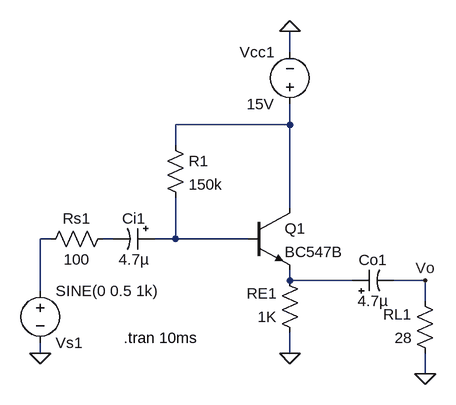
[diagram p0: schematic lab4.2f.asc]
lab4.2f.asc, the LTspice schematic file:
Version 4
SHEET 1 880 680
WIRE 224 -112 224 -144
WIRE 224 0 224 -32
WIRE 224 0 48 0
WIRE 48 32 48 0
WIRE 224 128 224 0
WIRE -144 176 -160 176
WIRE -48 176 -64 176
WIRE 48 176 48 112
WIRE 48 176 16 176
WIRE 160 176 48 176
WIRE 224 240 224 224
WIRE 320 240 224 240
WIRE 432 240 384 240
WIRE -160 256 -160 176
WIRE 432 272 432 240
WIRE -160 352 -160 336
WIRE 224 352 224 320
WIRE 432 384 432 352
FLAG 224 352 0
FLAG 224 -144 0
FLAG -160 352 0
FLAG 432 384 0
FLAG 432 240 Vo
SYMBOL res 240 336 R180
WINDOW 0 36 76 Left 2
WINDOW 3 36 40 Left 2
SYMATTR InstName RE1
SYMATTR Value 1K
SYMBOL npn 160 128 R0
SYMATTR InstName Q1
SYMATTR Value BC547B
SYMBOL voltage 224 -16 R180
WINDOW 0 24 96 Left 2
WINDOW 3 24 16 Left 2
WINDOW 123 0 0 Left 0
WINDOW 39 0 0 Left 0
SYMATTR InstName Vcc1
SYMATTR Value 15V
SYMBOL res 32 16 R0
SYMATTR InstName R1
SYMATTR Value 150k
SYMBOL res -48 160 R90
WINDOW 0 0 56 VBottom 2
WINDOW 3 32 56 VTop 2
SYMATTR InstName Rs1
SYMATTR Value 100
SYMBOL res 448 368 R180
WINDOW 0 36 76 Left 2
WINDOW 3 36 40 Left 2
SYMATTR InstName RL1
SYMATTR Value 28
SYMBOL polcap 16 160 R90
WINDOW 0 0 32 VBottom 2
WINDOW 3 32 32 VTop 2
SYMATTR InstName Ci1
SYMATTR Value 4.7µ
SYMATTR Description Capacitor
SYMATTR Type cap
SYMATTR SpiceLine V=50 Irms=30m Rser=4.7 Lser=0 mfg="Nichicon" pn="UPR1H4R7MAH" type="Al electrolytic"
SYMBOL voltage -160 240 R0
WINDOW 0 24 96 Left 2
WINDOW 3 24 16 Left 2
WINDOW 123 0 0 Left 0
WINDOW 39 0 0 Left 0
SYMATTR InstName Vs1
SYMATTR Value SINE(0 0.5 1k)
SYMBOL polcap 320 256 R270
WINDOW 0 32 32 VTop 2
WINDOW 3 0 32 VBottom 2
SYMATTR InstName Co1
SYMATTR Value 4.7µ
SYMATTR Description Capacitor
SYMATTR Type cap
SYMATTR SpiceLine V=50 Irms=30m Rser=4.7 Lser=0 mfg="Nichicon" pn="UPR1H4R7MAH" type="Al electrolytic"
TEXT -32 328 Left 2 !.tran 10ms

The netlist it stands for:
* lab4.2f.asc
RE1 0 N005 1K
Q1 N001 N004 N005 0 BC547B
Vcc1 N001 0 15V
R1 N001 N004 150k
Rs1 N003 N002 100
RL1 0 Vo 28
Ci1 N004 N003 4.7µ V=50 Irms=30m Rser=4.7 Lser=0 mfg="Nichicon" pn="UPR1H4R7MAH" type="Al electrolytic"
Vs1 N002 0 SINE(0 0.5 1k)
Co1 N005 Vo 4.7µ V=50 Irms=30m Rser=4.7 Lser=0 mfg="Nichicon" pn="UPR1H4R7MAH" type="Al electrolytic"
.model NPN NPN
.model PNP PNP
.lib standard.bjt
.tran 10ms
.backanno
.end